# EAGLE design EWElectrode (EAGLE 7.5.0)
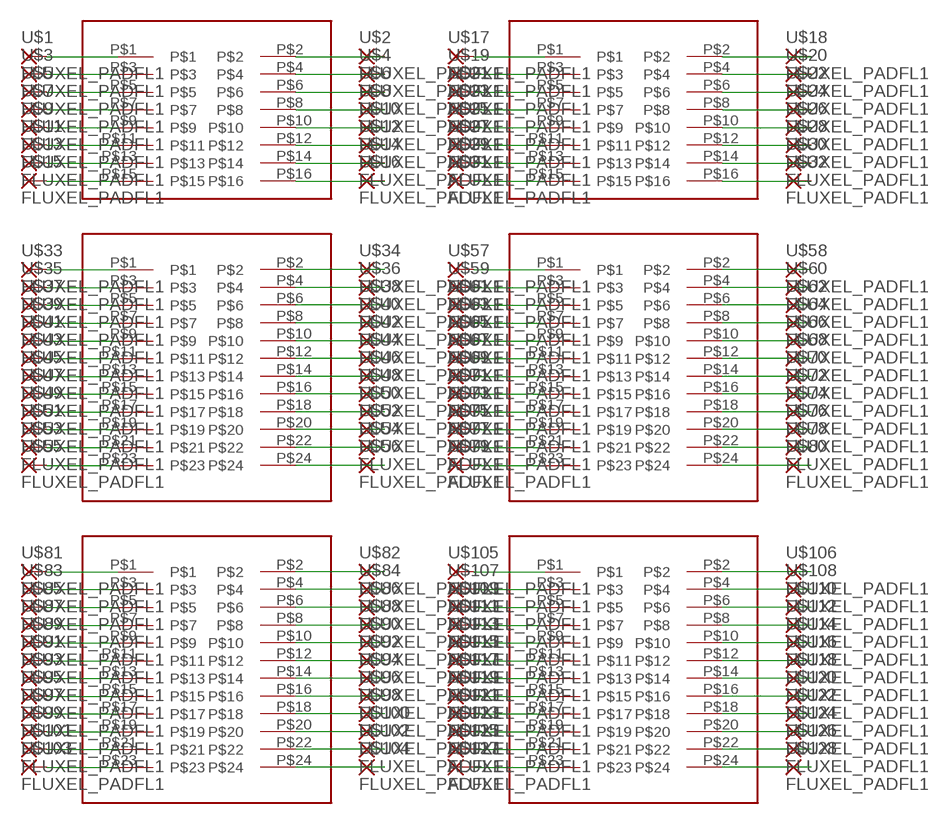
[diagram p0: schematic, sheet 1]

## Parts
J1  M20-876P_8X2  [M20-876P_8X2]
J2  M20-876P_8X2  [M20-876P_8X2]
J3  M20-876P_12X2  [M20-876P_12X2]
J4  M20-876P_12X2  [M20-876P_12X2]
J5  M20-876P_12X2  [M20-876P_12X2]
J6  M20-876P_12X2  [M20-876P_12X2]
U$1  FLUXEL_PADFL1  [FLUXEL_PAD]
U$2  FLUXEL_PADFL1  [FLUXEL_PAD]
U$3  FLUXEL_PADFL1  [FLUXEL_PAD]
U$4  FLUXEL_PADFL1  [FLUXEL_PAD]
U$5  FLUXEL_PADFL1  [FLUXEL_PAD]
U$6  FLUXEL_PADFL1  [FLUXEL_PAD]
U$7  FLUXEL_PADFL1  [FLUXEL_PAD]
U$8  FLUXEL_PADFL1  [FLUXEL_PAD]
U$9  FLUXEL_PADFL1  [FLUXEL_PAD]
U$10  FLUXEL_PADFL1  [FLUXEL_PAD]
U$11  FLUXEL_PADFL1  [FLUXEL_PAD]
U$12  FLUXEL_PADFL1  [FLUXEL_PAD]
U$13  FLUXEL_PADFL1  [FLUXEL_PAD]
U$14  FLUXEL_PADFL1  [FLUXEL_PAD]
U$15  FLUXEL_PADFL1  [FLUXEL_PAD]
U$16  FLUXEL_PADFL1  [FLUXEL_PAD]
U$17  FLUXEL_PADFL1  [FLUXEL_PAD]
U$18  FLUXEL_PADFL1  [FLUXEL_PAD]
U$19  FLUXEL_PADFL1  [FLUXEL_PAD]
U$20  FLUXEL_PADFL1  [FLUXEL_PAD]
U$21  FLUXEL_PADFL1  [FLUXEL_PAD]
U$22  FLUXEL_PADFL1  [FLUXEL_PAD]
U$23  FLUXEL_PADFL1  [FLUXEL_PAD]
U$24  FLUXEL_PADFL1  [FLUXEL_PAD]
U$25  FLUXEL_PADFL1  [FLUXEL_PAD]
U$26  FLUXEL_PADFL1  [FLUXEL_PAD]
U$27  FLUXEL_PADFL1  [FLUXEL_PAD]
U$28  FLUXEL_PADFL1  [FLUXEL_PAD]
U$29  FLUXEL_PADFL1  [FLUXEL_PAD]
U$30  FLUXEL_PADFL1  [FLUXEL_PAD]
U$31  FLUXEL_PADFL1  [FLUXEL_PAD]
U$32  FLUXEL_PADFL1  [FLUXEL_PAD]
U$33  FLUXEL_PADFL1  [FLUXEL_PAD]
U$34  FLUXEL_PADFL1  [FLUXEL_PAD]
U$35  FLUXEL_PADFL1  [FLUXEL_PAD]
U$36  FLUXEL_PADFL1  [FLUXEL_PAD]
U$37  FLUXEL_PADFL1  [FLUXEL_PAD]
U$38  FLUXEL_PADFL1  [FLUXEL_PAD]
U$39  FLUXEL_PADFL1  [FLUXEL_PAD]
U$40  FLUXEL_PADFL1  [FLUXEL_PAD]
U$41  FLUXEL_PADFL1  [FLUXEL_PAD]
U$42  FLUXEL_PADFL1  [FLUXEL_PAD]
U$43  FLUXEL_PADFL1  [FLUXEL_PAD]
U$44  FLUXEL_PADFL1  [FLUXEL_PAD]
U$45  FLUXEL_PADFL1  [FLUXEL_PAD]
U$46  FLUXEL_PADFL1  [FLUXEL_PAD]
U$47  FLUXEL_PADFL1  [FLUXEL_PAD]
U$48  FLUXEL_PADFL1  [FLUXEL_PAD]
U$49  FLUXEL_PADFL1  [FLUXEL_PAD]
U$50  FLUXEL_PADFL1  [FLUXEL_PAD]
U$51  FLUXEL_PADFL1  [FLUXEL_PAD]
U$52  FLUXEL_PADFL1  [FLUXEL_PAD]
U$53  FLUXEL_PADFL1  [FLUXEL_PAD]
U$54  FLUXEL_PADFL1  [FLUXEL_PAD]
U$55  FLUXEL_PADFL1  [FLUXEL_PAD]
U$56  FLUXEL_PADFL1  [FLUXEL_PAD]
U$57  FLUXEL_PADFL1  [FLUXEL_PAD]
U$58  FLUXEL_PADFL1  [FLUXEL_PAD]
U$59  FLUXEL_PADFL1  [FLUXEL_PAD]
U$60  FLUXEL_PADFL1  [FLUXEL_PAD]
U$61  FLUXEL_PADFL1  [FLUXEL_PAD]
U$62  FLUXEL_PADFL1  [FLUXEL_PAD]
U$63  FLUXEL_PADFL1  [FLUXEL_PAD]
U$64  FLUXEL_PADFL1  [FLUXEL_PAD]
U$65  FLUXEL_PADFL1  [FLUXEL_PAD]
U$66  FLUXEL_PADFL1  [FLUXEL_PAD]
U$67  FLUXEL_PADFL1  [FLUXEL_PAD]
U$68  FLUXEL_PADFL1  [FLUXEL_PAD]
U$69  FLUXEL_PADFL1  [FLUXEL_PAD]
U$70  FLUXEL_PADFL1  [FLUXEL_PAD]
U$71  FLUXEL_PADFL1  [FLUXEL_PAD]
U$72  FLUXEL_PADFL1  [FLUXEL_PAD]
U$73  FLUXEL_PADFL1  [FLUXEL_PAD]
U$74  FLUXEL_PADFL1  [FLUXEL_PAD]
U$75  FLUXEL_PADFL1  [FLUXEL_PAD]
U$76  FLUXEL_PADFL1  [FLUXEL_PAD]
U$77  FLUXEL_PADFL1  [FLUXEL_PAD]
U$78  FLUXEL_PADFL1  [FLUXEL_PAD]
U$79  FLUXEL_PADFL1  [FLUXEL_PAD]
U$80  FLUXEL_PADFL1  [FLUXEL_PAD]
U$81  FLUXEL_PADFL1  [FLUXEL_PAD]
U$82  FLUXEL_PADFL1  [FLUXEL_PAD]
U$83  FLUXEL_PADFL1  [FLUXEL_PAD]
U$84  FLUXEL_PADFL1  [FLUXEL_PAD]
U$85  FLUXEL_PADFL1  [FLUXEL_PAD]
U$86  FLUXEL_PADFL1  [FLUXEL_PAD]
U$87  FLUXEL_PADFL1  [FLUXEL_PAD]
U$88  FLUXEL_PADFL1  [FLUXEL_PAD]
U$89  FLUXEL_PADFL1  [FLUXEL_PAD]
U$90  FLUXEL_PADFL1  [FLUXEL_PAD]
U$91  FLUXEL_PADFL1  [FLUXEL_PAD]
U$92  FLUXEL_PADFL1  [FLUXEL_PAD]
U$93  FLUXEL_PADFL1  [FLUXEL_PAD]
U$94  FLUXEL_PADFL1  [FLUXEL_PAD]
U$95  FLUXEL_PADFL1  [FLUXEL_PAD]
U$96  FLUXEL_PADFL1  [FLUXEL_PAD]
U$97  FLUXEL_PADFL1  [FLUXEL_PAD]
U$98  FLUXEL_PADFL1  [FLUXEL_PAD]
U$99  FLUXEL_PADFL1  [FLUXEL_PAD]
U$100  FLUXEL_PADFL1  [FLUXEL_PAD]
U$101  FLUXEL_PADFL1  [FLUXEL_PAD]
U$102  FLUXEL_PADFL1  [FLUXEL_PAD]
U$103  FLUXEL_PADFL1  [FLUXEL_PAD]
U$104  FLUXEL_PADFL1  [FLUXEL_PAD]
U$105  FLUXEL_PADFL1  [FLUXEL_PAD]
U$106  FLUXEL_PADFL1  [FLUXEL_PAD]
U$107  FLUXEL_PADFL1  [FLUXEL_PAD]
U$108  FLUXEL_PADFL1  [FLUXEL_PAD]
U$109  FLUXEL_PADFL1  [FLUXEL_PAD]
U$110  FLUXEL_PADFL1  [FLUXEL_PAD]
U$111  FLUXEL_PADFL1  [FLUXEL_PAD]
U$112  FLUXEL_PADFL1  [FLUXEL_PAD]
U$113  FLUXEL_PADFL1  [FLUXEL_PAD]
U$114  FLUXEL_PADFL1  [FLUXEL_PAD]
U$115  FLUXEL_PADFL1  [FLUXEL_PAD]
U$116  FLUXEL_PADFL1  [FLUXEL_PAD]
U$117  FLUXEL_PADFL1  [FLUXEL_PAD]
U$118  FLUXEL_PADFL1  [FLUXEL_PAD]
U$119  FLUXEL_PADFL1  [FLUXEL_PAD]
U$120  FLUXEL_PADFL1  [FLUXEL_PAD]
U$121  FLUXEL_PADFL1  [FLUXEL_PAD]
U$122  FLUXEL_PADFL1  [FLUXEL_PAD]
U$123  FLUXEL_PADFL1  [FLUXEL_PAD]
U$124  FLUXEL_PADFL1  [FLUXEL_PAD]
U$125  FLUXEL_PADFL1  [FLUXEL_PAD]
U$126  FLUXEL_PADFL1  [FLUXEL_PAD]
U$127  FLUXEL_PADFL1  [FLUXEL_PAD]
U$128  FLUXEL_PADFL1  [FLUXEL_PAD]

## Nets
EW1: J1.P$1 U$1.1(P)
EW2: J1.P$3 U$3.1(P)
EW3: J1.P$5 U$5.1(P)
EW4: J1.P$7 U$7.1(P)
EW5: J1.P$9 U$9.1(P)
EW6: J1.P$11 U$11.1(P)
EW7: J1.P$13 U$13.1(P)
EW8: J1.P$15 U$15.1(P)
EW9: J1.P$2 U$2.1(P)
EW10: J1.P$4 U$4.1(P)
EW11: J1.P$6 U$6.1(P)
EW12: J1.P$8 U$8.1(P)
EW13: J1.P$10 U$10.1(P)
EW14: J1.P$12 U$12.1(P)
EW15: J1.P$14 U$14.1(P)
EW16: J1.P$16 U$16.1(P)
EW17: J2.P$1 U$17.1(P)
EW18: J2.P$3 U$19.1(P)
EW19: J2.P$5 U$21.1(P)
EW20: J2.P$7 U$23.1(P)
EW21: J2.P$9 U$25.1(P)
EW22: J2.P$11 U$27.1(P)
EW23: J2.P$13 U$29.1(P)
EW24: J2.P$15 U$31.1(P)
EW25: J2.P$2 U$18.1(P)
EW26: J2.P$4 U$20.1(P)
EW27: J2.P$6 U$22.1(P)
EW28: J2.P$8 U$24.1(P)
EW29: J2.P$10 U$26.1(P)
EW30: J2.P$12 U$28.1(P)
EW31: J2.P$14 U$30.1(P)
EW32: J2.P$16 U$32.1(P)
EW34: J3.P$3 U$35.1(P)
EW35: J3.P$5 U$37.1(P)
EW36: J3.P$7 U$39.1(P)
EW37: J3.P$9 U$41.1(P)
EW38: J3.P$11 U$43.1(P)
EW39: J3.P$13 U$45.1(P)
EW40: J3.P$15 U$47.1(P)
EW41: J3.P$17 U$49.1(P)
EW42: J3.P$19 U$51.1(P)
EW44: J3.P$23 U$55.1(P)
EW45: J3.P$2 U$34.1(P)
EW46: J3.P$4 U$36.1(P)
EW47: J3.P$6 U$38.1(P)
EW48: J3.P$8 U$40.1(P)
EW49: J3.P$10 U$42.1(P)
EW50: J3.P$12 U$44.1(P)
EW51: J3.P$14 U$46.1(P)
EW52: J3.P$16 U$48.1(P)
EW53: J3.P$18 U$50.1(P)
EW54: J3.P$20 U$52.1(P)
EW55: J3.P$22 U$54.1(P)
EW56: J3.P$24 U$56.1(P)
EW57: J4.P$1 U$57.1(P)
EW58: J4.P$3 U$59.1(P)
EW59: J4.P$5 U$61.1(P)
EW60: J4.P$7 U$63.1(P)
EW61: J4.P$9 U$65.1(P)
EW62: J4.P$11 U$67.1(P)
EW63: J4.P$13 U$69.1(P)
EW64: J4.P$15 U$71.1(P)
EW65: J4.P$17 U$73.1(P)
EW66: J4.P$19 U$75.1(P)
EW67: J4.P$21 U$77.1(P)
EW68: J4.P$23 U$79.1(P)
EW69: J4.P$2 U$58.1(P)
EW70: J4.P$4 U$60.1(P)
EW71: J4.P$6 U$62.1(P)
EW72: J4.P$8 U$64.1(P)
EW73: J4.P$10 U$66.1(P)
EW74: J4.P$12 U$68.1(P)
EW75: J4.P$14 U$70.1(P)
EW76: J4.P$16 U$72.1(P)
EW77: J4.P$18 U$74.1(P)
EW78: J4.P$20 U$76.1(P)
EW79: J4.P$22 U$78.1(P)
EW80: J4.P$24 U$80.1(P)
EW81: J5.P$1 U$81.1(P)
EW82: J5.P$3 U$83.1(P)
EW83: J5.P$5 U$85.1(P)
EW84: J5.P$7 U$87.1(P)
EW85: J5.P$9 U$89.1(P)
EW86: J5.P$11 U$91.1(P)
EW87: J5.P$13 U$93.1(P)
EW88: J5.P$15 U$95.1(P)
EW90: J5.P$19 U$99.1(P)
EW91: J5.P$21 U$101.1(P)
EW92: J5.P$23 U$103.1(P)
EW93: J5.P$2 U$82.1(P)
EW94: J5.P$4 U$84.1(P)
EW95: J5.P$6 U$86.1(P)
EW96: J5.P$8 U$88.1(P)
EW97: J5.P$10 U$90.1(P)
EW98: J5.P$12 U$92.1(P)
EW99: J5.P$14 U$94.1(P)
EW100: J5.P$16 U$96.1(P)
EW102: J5.P$20 U$100.1(P)
EW105: J6.P$1 U$105.1(P)
EW106: J6.P$3 U$107.1(P)
EW107: J6.P$5 U$109.1(P)
EW108: J6.P$7 U$111.1(P)
EW109: J6.P$9 U$113.1(P)
EW110: J6.P$11 U$115.1(P)
EW111: J6.P$13 U$117.1(P)
EW112: J6.P$15 U$119.1(P)
EW113: J6.P$17 U$121.1(P)
EW114: J6.P$19 U$123.1(P)
EW115: J6.P$21 U$125.1(P)
EW116: J6.P$23 U$127.1(P)
EW117: J6.P$2 U$106.1(P)
EW118: J6.P$4 U$108.1(P)
EW119: J6.P$6 U$110.1(P)
EW120: J6.P$8 U$112.1(P)
EW121: J6.P$10 U$114.1(P)
EW122: J6.P$12 U$116.1(P)
EW123: J6.P$14 U$118.1(P)
EW124: J6.P$16 U$120.1(P)
EW125: J6.P$18 U$122.1(P)
EW126: J6.P$20 U$124.1(P)
EW127: J6.P$22 U$126.1(P)
EW128: J6.P$24 U$128.1(P)
EW137: J3.P$21 U$53.1(P)
EW166: J5.P$18 U$98.1(P)
EW236: J5.P$17 U$97.1(P)
EW261: J3.P$1 U$33.1(P)
EW287: J5.P$22 U$102.1(P)
EW289: J5.P$24 U$104.1(P)

## Library data of the parts
J1 J2 = ben:M20-876P_8X2
J3-J6 = ben:M20-876P_12X2
U$1-U$128 = ben:FLUXEL_PAD

## Board
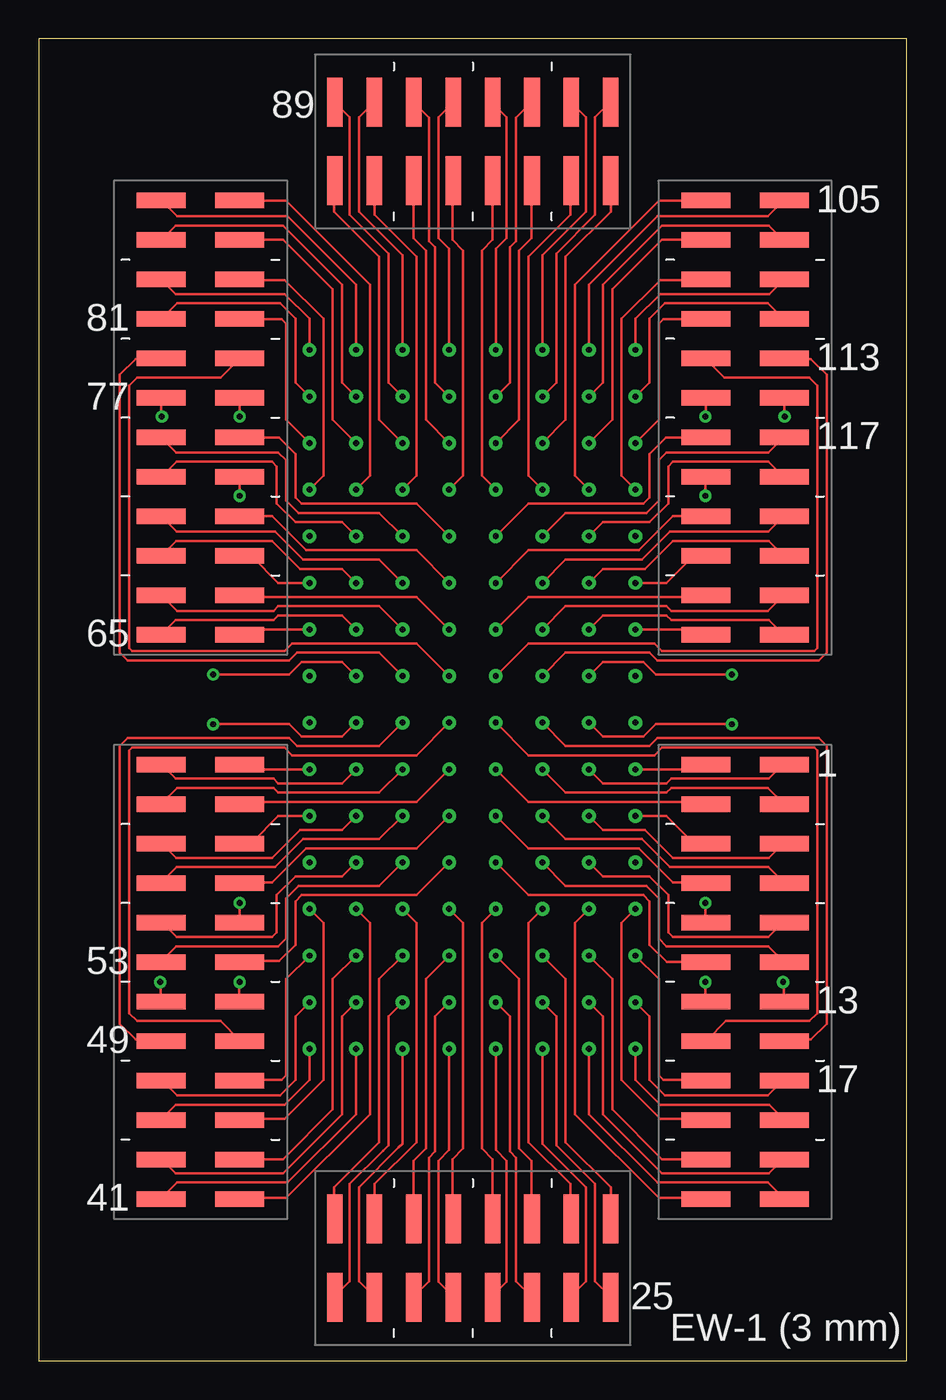
[diagram p1: board, top side]
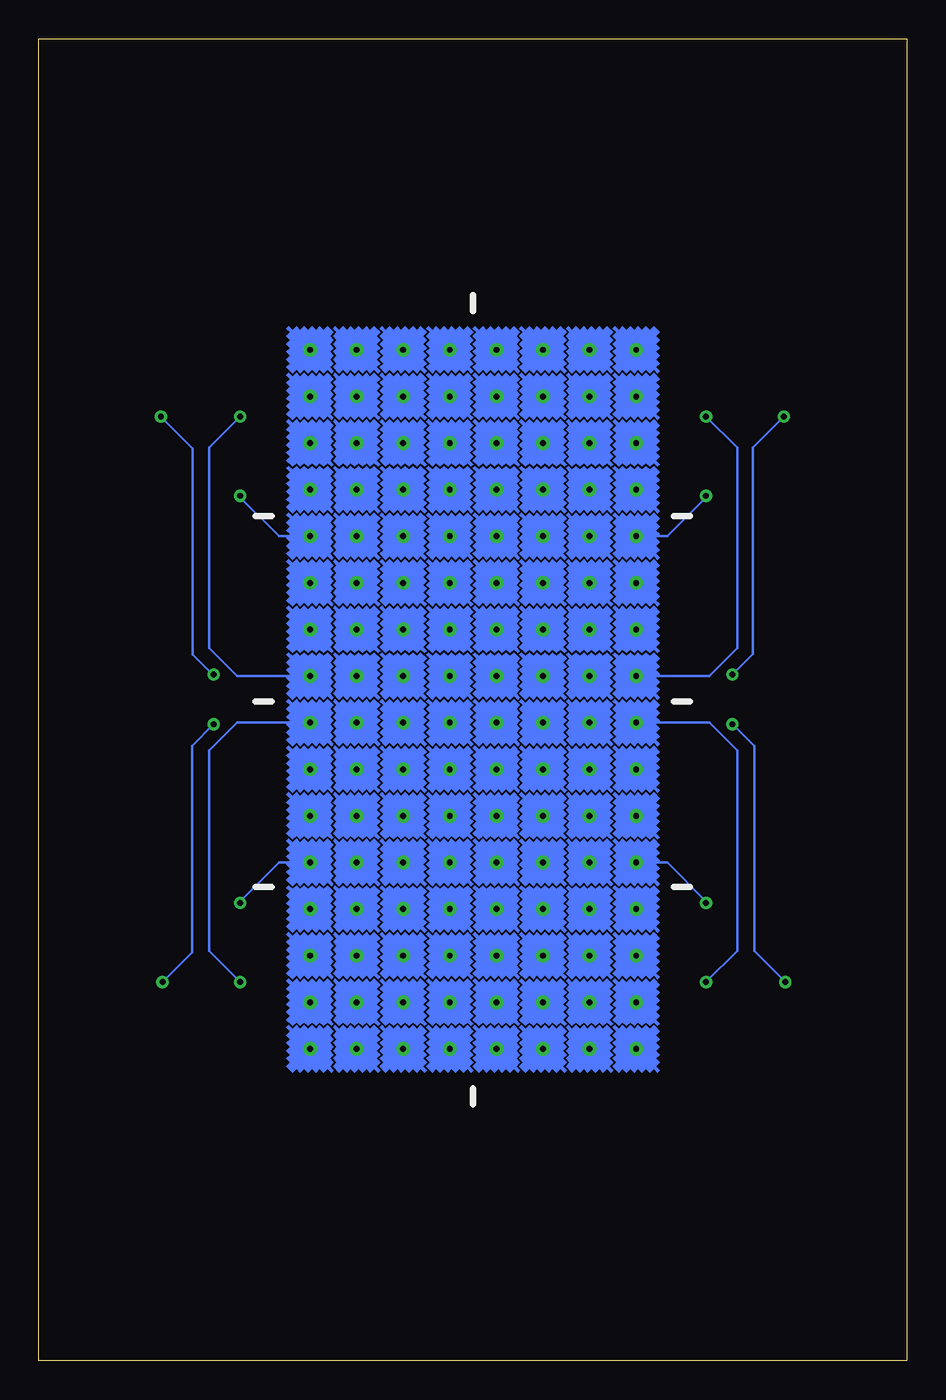
[diagram p2: board, bottom side, seen from below]

Size 55.88 x 85.09 mm. Coordinates in mm from the lower left corner, seen from the top.
Outline: 0,0 55.88,0 55.88,85.09 0,85.09 0,0
Copper layers (1*16): Top 0.035559375mm / dielectric 1.501140625mm / Bottom 0.035559375mm
Design rules "typical_4pcb *": minimum track width 6mil, minimum drill 15mil, track to track 6mil, track to pad 6mil, pad to pad 6mil, via to via 6mil, smd to smd 6mil, copper to edge 15mil, drill to drill 8mil, minimum pad ring 10mil, minimum via ring 8mil, stop-mask expansion 4mil, vias tented up to drill 0mil, thermal gap 10mil

### Footprints (pad centres in the part's own frame; a part is rotated, then mirrored left to right if it is on the bottom)
M20-876P_8X2 = smd 1 x 3.15: P$1 -8.89,-2.525; P$2 -8.89,2.525; P$3 -6.35,-2.525; P$4 -6.35,2.525; P$5 -3.81,-2.525; P$6 -3.81,2.525; P$7 -1.27,-2.525; P$8 -1.27,2.525; P$9 1.27,-2.525; P$10 1.27,2.525; P$11 3.81,-2.525; P$12 3.81,2.525; P$13 6.35,-2.525; P$14 6.35,2.525; P$15 8.89,-2.525; P$16 8.89,2.525
M20-876P_12X2 = smd 1 x 3.15: P$1 -13.97,-2.525; P$2 -13.97,2.525; P$3 -11.43,-2.525; P$4 -11.43,2.525; P$5 -8.89,-2.525; P$6 -8.89,2.525; P$7 -6.35,-2.525; P$8 -6.35,2.525; P$9 -3.81,-2.525; P$10 -3.81,2.525; P$11 -1.27,-2.525; P$12 -1.27,2.525; P$13 1.27,-2.525; P$14 1.27,2.525; P$15 3.81,-2.525; P$16 3.81,2.525; P$17 6.35,-2.525; P$18 6.35,2.525; P$19 8.89,-2.525; P$20 8.89,2.525; P$21 11.43,-2.525; P$22 11.43,2.525; P$23 13.97,-2.525; P$24 13.97,2.525
FLUXEL_PAD = drill 0.381 pad 0.635: 1 0,0

### Placement (x,y rotation side)
J1  27.94,78.49 0 top
J2  27.94,6.6 0 top
J3  10.41,24.38 90 top
J4  45.47,24.38 270 top
J5  10.41,60.71 90 top
J6  45.47,60.71 270 top
U$1  23.42,59.07 0 top
U$2  23.42,62.07 0 top
U$3  23.42,56.07 0 top
U$4  23.42,65.07 0 top
U$5  26.42,59.07 0 top
U$6  26.42,62.07 0 top
U$7  26.42,56.07 0 top
U$8  26.42,65.07 0 top
U$9  29.42,56.07 0 top
U$10  29.42,65.07 0 top
U$11  29.42,59.07 180 top
U$12  29.42,62.07 180 top
U$13  32.42,56.07 0 top
U$14  32.42,65.07 0 top
U$15  32.42,59.07 0 top
U$16  32.42,62.07 0 top
U$17  23.42,23.07 0 top
U$18  23.42,26.07 0 top
U$19  23.42,20.07 0 top
U$20  23.42,29.07 0 top
U$21  26.42,23.07 0 top
U$22  26.42,26.07 0 top
U$23  26.42,20.07 0 top
U$24  26.42,29.07 0 top
U$25  29.42,20.07 0 top
U$26  29.42,29.07 0 top
U$27  29.42,23.07 0 top
U$28  29.42,26.07 0 top
U$29  32.42,20.07 0 top
U$30  32.42,29.07 0 top
U$31  32.42,23.07 0 top
U$32  32.42,26.07 0 top
U$33  20.42,29.07 0 top
U$34  20.42,20.07 0 top
U$35  20.42,26.07 0 top
U$36  20.42,23.07 0 top
U$37  17.42,29.07 0 top
U$38  17.42,20.07 0 top
U$39  17.42,26.07 0 top
U$40  17.42,23.07 0 top
U$41  26.42,41.07 0 top
U$42  23.42,41.07 0 top
U$43  17.42,41.07 0 top
U$44  20.42,41.07 0 top
U$45  26.42,32.07 0 top
U$46  23.42,32.07 0 top
U$47  17.42,32.07 0 top
U$48  20.42,32.07 0 top
U$49  26.42,35.07 0 top
U$50  23.42,35.07 0 top
U$51  17.42,35.07 0 top
U$52  20.42,35.07 0 top
U$53  26.42,38.07 0 top
U$54  23.42,38.07 0 top
U$55  17.42,38.07 0 top
U$56  20.42,38.07 0 top
U$57  38.42,38.07 0 top
U$58  35.42,38.07 0 top
U$59  29.42,38.07 0 top
U$60  32.42,38.07 0 top
U$61  38.42,35.07 0 top
U$62  35.42,35.07 0 top
U$63  29.42,35.07 0 top
U$64  32.42,35.07 0 top
U$65  38.42,32.07 0 top
U$66  35.42,32.07 0 top
U$67  29.42,32.07 0 top
U$68  32.42,32.07 0 top
U$69  38.42,41.07 0 top
U$70  35.42,41.07 0 top
U$71  29.42,41.07 0 top
U$72  32.42,41.07 0 top
U$73  38.42,26.07 0 top
U$74  38.42,23.07 0 top
U$75  38.42,29.07 0 top
U$76  38.42,20.07 0 top
U$77  35.42,26.07 0 top
U$78  35.42,23.07 0 top
U$79  35.42,29.07 0 top
U$80  35.42,20.07 0 top
U$81  17.42,47.07 0 top
U$82  20.42,47.07 0 top
U$83  26.42,47.07 0 top
U$84  23.42,47.07 0 top
U$85  17.42,50.07 0 top
U$86  20.42,50.07 0 top
U$87  26.42,50.07 0 top
U$88  23.42,50.07 0 top
U$89  17.42,53.07 0 top
U$90  20.42,53.07 0 top
U$91  26.42,53.07 0 top
U$92  23.42,53.07 0 top
U$93  17.42,44.07 0 top
U$94  20.42,44.07 0 top
U$95  26.42,44.07 0 top
U$96  23.42,44.07 0 top
U$97  17.42,59.07 0 top
U$98  17.42,62.07 0 top
U$99  17.42,56.07 0 top
U$100  17.42,65.07 0 top
U$101  20.42,59.07 0 top
U$102  20.42,62.07 0 top
U$103  20.42,56.07 0 top
U$104  20.42,65.07 0 top
U$105  35.42,56.07 0 top
U$106  35.42,65.07 0 top
U$107  35.42,59.07 0 top
U$108  35.42,62.07 0 top
U$109  38.42,56.07 0 top
U$110  38.42,65.07 0 top
U$111  38.42,59.07 0 top
U$112  38.42,62.07 0 top
U$113  29.42,44.07 0 top
U$114  32.42,44.07 0 top
U$115  38.42,44.07 0 top
U$116  35.42,44.07 0 top
U$117  29.42,53.07 0 top
U$118  32.42,53.07 0 top
U$119  38.42,53.07 0 top
U$120  35.42,53.07 0 top
U$121  29.42,50.07 0 top
U$122  32.42,50.07 0 top
U$123  38.42,50.07 0 top
U$124  35.42,50.07 0 top
U$125  29.42,47.07 0 top
U$126  32.42,47.07 0 top
U$127  38.42,47.07 0 top
U$128  35.42,47.07 0 top

### Tracks (layer width: path | path; a pad name or v marks a point on that pad's centre or on a via)
EW1
  Top 0.152: U$1.1 21.92,60.57 21.92,71.07 19.02,73.97 19.02,75.93 J1.P$1
EW2
  Top 0.152: U$3.1 24.32,56.97 24.32,71.07 21.62,73.77 21.62,75.93 J1.P$3
EW3
  Top 0.152: U$5.1 24.92,60.57 24.92,71.47 24.12,72.27 J1.P$5
EW4
  Top 0.152: U$7.1 27.32,56.97 27.32,71.47 26.62,72.17 26.62,75.91 J1.P$7
EW5
  Top 0.152: U$9.1 28.52,56.97 28.52,71.47 29.22,72.17 29.22,75.91 | 29.22,75.91 29.17,75.96 | 29.22,75.91 J1.P$9
EW6
  Top 0.152: U$11.1 30.92,60.57 30.92,71.47 31.72,72.27 31.72,75.95 | 31.72,75.95 31.71,75.96 | J1.P$11 31.73,75.96 31.72,75.95
EW7
  Top 0.152: U$13.1 31.52,56.97 31.52,71.07 34.22,73.77 34.22,75.93 34.25,75.96 J1.P$13
EW8
  Top 0.152: U$15.1 33.92,60.57 33.92,71.07 36.82,73.97 36.82,75.93 | 36.82,75.93 36.79,75.96 | J1.P$15 36.83,75.94 36.82,75.93
EW9
  Top 0.152: U$2.1 22.52,62.97 22.52,71.27 20.02,73.77 20.02,80.04 J1.P$2
EW10
  Top 0.152: U$4.1 23.42,71.17 20.62,73.97 20.62,80.04 J1.P$4
EW11
  Top 0.152: U$6.1 25.52,62.97 25.52,71.67 25.12,72.07 25.12,80.02 J1.P$6
EW12
  Top 0.152: U$8.1 26.42,71.57 25.72,72.27 25.72,80.06 J1.P$8
EW13
  Top 0.152: U$10.1 29.42,71.57 30.12,72.27 30.12,80.06 29.22,80.96 29.21,80.97 | 29.21,80.97 29.17,81.01 | J1.P$10 29.21,80.97
EW14
  Top 0.152: U$12.1 30.32,62.97 30.32,71.67 30.72,72.07 30.72,80.02 31.71,81.01 J1.P$12
EW15
  Top 0.152: U$14.1 32.42,71.17 35.22,73.97 35.22,80.04 34.31,80.96 34.29,80.97 | 34.29,80.97 34.25,81.01 | J1.P$14 34.29,80.97
EW16
  Top 0.152: U$16.1 33.32,62.97 33.32,71.27 35.82,73.77 35.82,80.04 36.79,81.01 J1.P$16
EW17
  Top 0.152: U$17.1 22.52,22.17 22.52,13.87 22.17,13.52 20.02,11.37 20.02,5.1 19.05,4.13 | 19.01,4.13 19.05,4.13 | J2.P$1 19.05,4.13
EW18
  Top 0.152: 21.55,4.17 20.62,5.1 20.62,11.17 23.17,13.72 23.42,13.97 U$19.1 | 21.55,4.17 21.59,4.13 J2.P$3 | 21.55,4.13 21.55,4.17
EW19
  Top 0.152: U$21.1 25.52,22.17 25.52,13.47 25.12,13.07 25.12,5.12 24.13,4.13 | 24.09,4.13 24.13,4.13 | 24.13,4.13 J2.P$5
EW20
  Top 0.152: 26.63,4.17 25.72,5.08 25.72,12.87 26.42,13.57 U$23.1 | 26.63,4.17 26.67,4.13 | 26.63,4.17 26.63,4.13 J2.P$7
EW21
  Top 0.152: U$25.1 29.42,13.57 30.12,12.87 30.12,5.08 29.21,4.17 | 29.21,4.17 29.17,4.13 J2.P$9 | 29.21,4.13 29.21,4.17
EW22
  Top 0.152: U$27.1 30.32,22.17 30.32,13.47 30.72,13.07 30.72,5.12 31.71,4.13 | 31.75,4.13 31.71,4.13 | J2.P$11 31.71,4.13
EW23
  Top 0.152: U$29.1 32.42,13.97 35.22,11.17 35.22,5.1 34.29,4.17 | 34.29,4.17 34.25,4.13 J2.P$13 | 34.29,4.13 34.29,4.17
EW24
  Top 0.152: U$31.1 33.32,22.17 33.32,13.87 35.82,11.37 35.82,5.1 36.79,4.13 36.83,4.13 J2.P$15
EW25
  Top 0.152: U$18.1 21.92,24.57 21.92,14.07 19.02,11.17 19.02,9.21 | 19.02,9.21 19.05,9.18 | 19.02,9.21 19.01,9.2 19.01,9.18 J2.P$2
EW26
  Top 0.152: U$20.1 24.32,28.17 24.32,14.07 21.62,11.37 21.62,9.21 21.59,9.18 21.55,9.18 J2.P$4
EW27
  Top 0.152: U$22.1 24.92,24.57 24.92,13.67 24.12,12.87 24.12,9.19 | 24.12,9.19 24.13,9.18 J2.P$6 | 24.09,9.18 24.11,9.18 24.12,9.19
EW28
  Top 0.152: U$24.1 27.32,28.17 27.32,13.67 26.62,12.97 26.62,9.23 | 26.62,9.23 26.67,9.18 J2.P$8 | 26.62,9.23 26.62,9.19 26.63,9.18
EW29
  Top 0.152: 29.22,9.23 29.22,12.97 28.52,13.67 28.52,28.17 U$26.1 | 29.22,9.23 29.17,9.18 | 29.22,9.23 29.22,9.19 29.21,9.18 J2.P$10
EW30
  Top 0.152: U$28.1 30.92,24.57 30.92,13.67 31.72,12.87 31.72,9.19 | 31.72,9.19 31.71,9.18 J2.P$12 | 31.75,9.18 31.73,9.18 31.72,9.19
EW31
  Top 0.152: U$30.1 31.52,28.17 31.52,14.07 34.22,11.37 34.22,9.21 34.25,9.18 34.29,9.18 J2.P$14
EW32
  Top 0.152: U$32.1 33.92,24.57 33.92,14.07 36.82,11.17 36.82,9.21 | 36.82,9.21 36.79,9.18 | 36.82,9.21 36.83,9.2 36.83,9.18 J2.P$16
EW34
  Top 0.152: U$35.1 18.92,24.57 18.92,16.17 15.72,12.97 12.97,12.97 | 12.97,12.97 12.94,13 12.9,13 | 12.97,12.97 12.96,12.97 J3.P$3
EW35
  Top 0.152: U$37.1 18.32,28.17 18.32,18.07 15.82,15.57 12.96,15.57 12.94,15.54 | 12.9,15.54 12.94,15.54 | J3.P$5 12.94,15.54
EW36
  Top 0.152: U$39.1 15.92,24.57 15.92,18.37 15.63,18.08 12.9,18.08 12.94,18.04 J3.P$7
EW37
  Top 0.152: U$41.1 24.32,38.97 16.32,38.97 15.82,39.47 6.02,39.47 5.82,39.27 5.82,22.37 6.32,21.87 11.69,21.87 12.94,20.62 | 12.94,20.62 12.9,20.62 | J3.P$9 12.94,20.62
EW38  (via drill 0.38)
  Top 0.152: v12.92,24.37 12.9,24.35 12.9,23.15 J3.P$11
  Bottom 0.152: U$43.1 12.72,41.07 10.92,39.27 10.92,26.37 v12.92,24.37
EW39
  Top 0.152: U$45.1 24.32,29.97 16.92,29.97 16.52,29.57 16.52,26.77 15.47,25.72 12.96,25.72 12.94,25.7 12.9,25.7 12.94,25.66 J3.P$13
EW40  (via drill 0.38)
  Top 0.152: v12.92,29.47 12.92,28.26 12.94,28.24 | 12.9,28.24 12.94,28.24 | J3.P$15 12.94,28.24
  Bottom 0.152: U$47.1 15.42,32.07 12.92,29.57 v12.92,29.47
EW41
  Top 0.152: U$49.1 24.32,32.97 17.22,32.97 15.02,30.77 13.02,30.77 | 13.02,30.77 12.95,30.77 12.94,30.78 12.9,30.78 | J3.P$17 12.98,30.73 13.02,30.77
EW42
  Top 0.152: U$51.1 15.42,35.07 13.72,33.37 12.98,33.37 12.94,33.32 | 12.9,33.32 12.94,33.32 | J3.P$19 12.94,33.32
EW44
  Top 0.152: U$55.1 13.27,38.07 12.94,38.4 | 12.9,38.4 12.94,38.4 | 12.94,38.4 J3.P$23
EW45
  Top 0.152: 7.85,10.46 7.89,10.46 | U$34.1 20.42,15.87 16.02,11.47 8.89,11.47 7.91,10.48 7.89,10.46 | J3.P$2 7.89,10.46
EW46
  Top 0.152: U$36.1 19.52,22.17 19.52,15.87 15.72,12.07 8.82,12.07 7.92,12.97 | 7.92,12.97 7.89,13 7.85,13 | J3.P$4 7.9,12.95 7.92,12.97
EW47
  Top 0.152: U$38.1 17.42,18.07 15.82,16.47 8.81,16.47 7.89,15.54 | 7.85,15.54 7.89,15.54 | 7.89,15.54 J3.P$6
EW48
  Top 0.152: U$40.1 16.52,22.17 16.52,18.07 15.52,17.07 8.9,17.07 7.89,18.08 | 7.85,18.08 7.89,18.08 | 7.89,18.08 J3.P$8
EW49
  Top 0.152: U$42.1 21.92,39.57 16.62,39.57 16.12,40.07 5.72,40.07 5.22,39.57 5.22,21.67 6.22,20.67 7.8,20.67 | 7.8,20.67 7.84,20.67 7.89,20.62 | 7.8,20.67 7.85,20.62 7.85,20.61 J3.P$10
EW50  (via drill 0.38)
  Top 0.152: U$44.1 19.52,40.17 16.92,40.17 16.12,40.97 v11.22,40.97 | v7.82,24.37 7.85,24.34 7.85,23.15 J3.P$12
  Bottom 0.152: v11.22,40.97 9.82,39.57 9.82,26.37 v7.82,24.37 v7.82,24.38
EW51
  Top 0.152: U$46.1 21.92,30.57 16.72,30.57 15.92,29.77 15.92,27.17 15.42,26.67 8.86,26.67 7.89,25.7 7.85,25.7 7.89,25.66 J3.P$14
EW52
  Top 0.152: U$48.1 19.52,31.17 16.52,31.17 15.32,29.97 15.32,27.57 15.02,27.27 8.86,27.27 7.89,28.24 7.85,28.24 7.89,28.2 J3.P$16
EW53
  Top 0.152: U$50.1 21.92,33.57 17.02,33.57 15.22,31.77 8.88,31.77 7.89,30.78 | 7.85,30.78 7.89,30.78 | 7.89,30.78 J3.P$18
EW54
  Top 0.152: U$52.1 19.52,34.17 16.82,34.17 15.02,32.37 8.84,32.37 8.03,33.18 7.94,33.27 | 7.94,33.27 7.89,33.32 7.85,33.32 | J3.P$20 7.94,33.27
EW55
  Top 0.152: U$54.1 21.92,36.57 15.42,36.57 15.12,36.87 8.89,36.87 7.89,35.86 | 7.85,35.86 7.89,35.86 | 7.89,35.86 J3.P$22
EW56
  Top 0.152: U$56.1 19.52,37.17 15.42,37.17 15.12,37.47 8.82,37.47 7.97,38.32 7.94,38.35 | 7.94,38.35 7.89,38.4 7.85,38.4 | J3.P$24 7.94,38.35
EW57
  Top 0.152: 42.62,37.97 42.62,38.03 J4.P$1 42.2,38.35 41.92,38.07 U$57.1
EW58
  Top 0.152: U$59.1 31.52,35.97 42.78,35.97 J4.P$3
EW59
  Top 0.152: U$61.1 40.42,35.07 42.12,33.37 42.85,33.37 42.9,33.32 42.9,33.31 J4.P$5
EW60
  Top 0.152: U$63.1 31.52,32.97 38.62,32.97 40.82,30.77 42.89,30.77 | 42.89,30.77 42.9,30.78 | J4.P$7 42.92,30.73 42.89,30.77
EW61  (via drill 0.38)
  Top 0.152: v42.92,29.47 42.92,28.26 | 42.92,28.26 42.9,28.24 | J4.P$9 43.34,28.19 43.42,28.27 42.93,28.27 42.92,28.26
  Bottom 0.152: U$65.1 40.42,32.07 42.92,29.57 v42.92,29.47
EW62
  Top 0.152: U$67.1 31.52,29.97 38.92,29.97 39.32,29.57 39.32,26.77 40.44,25.65 J4.P$11
EW63  (via drill 0.38)
  Top 0.152: v42.92,24.37 42.92,23.18 | 42.92,23.18 42.9,23.16 | J4.P$13 42.92,23.13 42.92,23.18
  Bottom 0.152: U$69.1 43.12,41.07 44.92,39.27 44.92,26.37 v42.92,24.37
EW64
  Top 0.152: U$71.1 31.52,38.97 39.62,38.97 40.12,39.47 49.92,39.47 50.12,39.27 50.12,22.37 49.62,21.87 44.25,21.87 43,20.62 42.99,20.62 J4.P$15
EW65
  Top 0.152: U$73.1 39.92,24.57 39.92,18.37 40.21,18.08 42.94,18.08 J4.P$17
EW66
  Top 0.152: U$75.1 37.52,28.17 37.52,18.07 40.02,15.57 42.88,15.57 42.9,15.54 42.94,15.54 J4.P$19
EW67
  Top 0.152: U$77.1 36.92,24.57 36.92,16.17 40.12,12.97 42.87,12.97 42.89,13 | 42.89,13 42.9,13 42.94,13 42.93,13 42.89,13 | J4.P$21 42.89,13
EW68
  Top 0.152: 42.82,10.47 39.92,10.47 34.52,15.87 34.52,28.17 U$79.1 | 42.82,10.47 42.89,10.47 42.9,10.46 42.94,10.46 | J4.P$23 42.88,10.41 42.82,10.47
EW69
  Top 0.152: U$58.1 36.32,37.17 40.42,37.17 40.72,37.47 47.02,37.47 47.95,38.4 47.99,38.36 J4.P$2
EW70
  Top 0.152: U$60.1 33.92,36.57 40.42,36.57 40.72,36.87 46.95,36.87 47.95,35.86 47.95,35.85 J4.P$4
EW71
  Top 0.152: U$62.1 36.32,34.17 39.02,34.17 40.82,32.37 47,32.37 47.95,33.32 47.99,33.28 J4.P$6
EW72
  Top 0.152: U$64.1 33.92,33.57 38.82,33.57 40.62,31.77 46.96,31.77 47.95,30.78 47.95,30.77 J4.P$8
EW73
  Top 0.152: U$66.1 36.32,31.17 39.32,31.17 40.52,29.97 40.52,27.57 40.82,27.27 46.98,27.27 47.95,28.24 47.95,28.23 J4.P$10
EW74
  Top 0.152: U$68.1 33.92,30.57 39.12,30.57 39.92,29.77 39.92,27.17 40.42,26.67 46.98,26.67 47.99,25.66 J4.P$12
EW75  (via drill 0.38)
  Top 0.152: U$70.1 36.32,40.17 38.92,40.17 39.72,40.97 v44.62,40.97 | v47.92,24.37 47.95,24.14 47.95,23.15 J4.P$14
  Bottom 0.152: v44.62,40.97 46.02,39.57 46.02,26.27 v47.92,24.37 47.92,24.48
EW76
  Top 0.152: U$72.1 33.92,39.57 39.32,39.57 39.82,40.07 50.22,40.07 50.72,39.57 50.72,21.67 49.72,20.67 48.1,20.67 48,20.57 J4.P$16
EW77
  Top 0.152: U$74.1 39.32,22.17 39.32,18.07 40.32,17.07 46.94,17.07 47.95,18.08 47.95,18.07 J4.P$18
EW78
  Top 0.152: U$76.1 38.42,18.07 40.02,16.47 47.02,16.47 47.99,15.5 J4.P$20
EW79
  Top 0.152: U$78.1 36.32,22.17 36.32,15.87 40.12,12.07 47.02,12.07 47.95,13 47.99,12.96 J4.P$22
EW80
  Top 0.152: U$80.1 35.42,15.87 39.82,11.47 46.95,11.47 47.99,10.42 J4.P$24
EW81
  Top 0.152: U$81.1 13.27,47.07 J5.P$1
EW82
  Top 0.152: U$83.1 24.32,49.17 13.04,49.17 J5.P$3
EW83
  Top 0.152: U$85.1 15.42,50.07 13.72,51.77 12.98,51.77 J5.P$5
EW84
  Top 0.152: U$87.1 24.32,52.17 17.22,52.17 15.02,54.37 12.95,54.37 J5.P$7
EW85  (via drill 0.38)
  Top 0.152: v12.92,55.67 12.92,56.88 J5.P$9
  Bottom 0.152: U$89.1 15.42,53.07 12.92,55.57 v12.92,55.67
EW86
  Top 0.152: J5.P$11 12.96,59.42 15.47,59.42 16.52,58.37 16.52,55.57 16.92,55.17 24.32,55.17 U$91.1
EW87  (via drill 0.38)
  Top 0.152: v12.92,60.77 12.92,61.96 J5.P$13
  Bottom 0.152: U$93.1 12.72,44.07 10.92,45.87 10.92,58.77 v12.92,60.77
EW88
  Top 0.152: U$95.1 24.32,46.17 16.32,46.17 15.82,45.67 6.02,45.67 5.82,45.87 5.82,62.77 6.32,63.27 11.69,63.27 J5.P$15
EW90
  Top 0.152: U$99.1 18.32,56.97 18.32,67.07 15.82,69.57 12.96,69.57 J5.P$19
EW91
  Top 0.152: U$101.1 18.92,60.57 18.92,68.97 15.72,72.17 12.97,72.17 J5.P$21
EW92
  Top 0.152: U$103.1 21.32,56.97 21.32,69.27 15.92,74.67 J5.P$23
EW93
  Top 0.152: U$82.1 19.52,47.97 15.42,47.97 15.12,47.67 8.82,47.67 J5.P$2
EW94
  Top 0.152: U$84.1 21.92,48.57 15.42,48.57 15.12,48.27 8.89,48.27 J5.P$4
EW95
  Top 0.152: U$86.1 19.52,50.97 16.82,50.97 15.02,52.77 8.84,52.77 J5.P$6
EW96
  Top 0.152: U$88.1 21.92,51.57 17.02,51.57 15.22,53.37 8.88,53.37 J5.P$8
EW97
  Top 0.152: U$90.1 19.52,53.97 16.52,53.97 15.32,55.17 15.32,57.57 15.02,57.87 8.86,57.87 J5.P$10
EW98
  Top 0.152: U$92.1 21.92,54.57 16.72,54.57 15.92,55.37 15.92,57.97 15.42,58.47 8.86,58.47 J5.P$12
EW99  (via drill 0.38)
  Top 0.152: U$94.1 19.52,44.97 16.92,44.97 16.12,44.17 v11.22,44.17 | J5.P$14 7.89,61 v7.92,60.77
  Bottom 0.152: v7.92,60.77 v7.92,60.76 9.91,58.77 9.91,45.48 v11.22,44.17
EW100
  Top 0.152: U$96.1 21.92,45.57 16.62,45.57 16.12,45.07 5.72,45.07 5.22,45.57 5.22,63.47 6.22,64.47 7.84,64.47 J5.P$16
EW102
  Top 0.152: U$100.1 17.42,67.07 15.82,68.67 8.81,68.67 J5.P$20
EW105
  Top 0.152: U$105.1 34.52,56.97 34.52,69.27 39.92,74.67 42.89,74.67 42.9,74.68 J6.P$1
EW106
  Top 0.152: U$107.1 36.92,60.57 36.92,68.97 40.12,72.17 42.87,72.17 42.9,72.14 J6.P$3
EW107
  Top 0.152: U$109.1 37.52,56.97 37.52,67.07 40.02,69.57 42.88,69.57 42.9,69.6 J6.P$5
EW108
  Top 0.152: U$111.1 39.92,60.57 39.92,66.77 40.21,67.06 J6.P$7
EW109
  Top 0.152: U$113.1 31.52,46.17 39.62,46.17 40.12,45.67 49.92,45.67 50.12,45.87 50.12,62.77 49.62,63.27 44.15,63.27 42.9,64.52 J6.P$9
EW110  (via drill 0.38)
  Top 0.152: v42.92,60.77 42.94,60.79 J6.P$11
  Bottom 0.152: U$115.1 43.12,44.07 44.92,45.87 44.92,58.77 v42.92,60.77
EW111
  Top 0.152: U$117.1 31.52,55.17 38.92,55.17 39.32,55.57 39.32,58.37 40.37,59.42 42.88,59.42 42.9,59.44 J6.P$13
EW112  (via drill 0.38)
  Top 0.152: v42.92,55.67 42.92,56.88 42.9,56.9 J6.P$15
  Bottom 0.152: U$119.1 40.42,53.07 42.92,55.57 v42.92,55.67
EW113
  Top 0.152: U$121.1 31.52,52.17 38.62,52.17 40.82,54.37 42.89,54.37 42.9,54.36 J6.P$17
EW114
  Top 0.152: U$123.1 40.42,50.07 42.12,51.77 42.85,51.77 42.9,51.82 J6.P$19
EW115
  Top 0.152: U$125.1 31.52,49.17 42.79,49.17 42.9,49.28 J6.P$21
EW116
  Top 0.152: U$127.1 42.57,47.07 42.9,46.74 J6.P$23
EW117
  Top 0.152: U$106.1 35.42,69.27 39.82,73.67 46.95,73.67 47.95,74.68 J6.P$2
EW118
  Top 0.152: U$108.1 36.32,62.97 36.32,69.27 40.12,73.07 47.02,73.07 47.95,72.14 J6.P$4
EW119
  Top 0.152: U$110.1 38.42,67.07 40.02,68.67 47.02,68.67 47.95,69.6 J6.P$6
EW120
  Top 0.152: U$112.1 39.32,62.97 39.32,67.07 40.32,68.07 46.94,68.07 47.95,67.06 J6.P$8
EW121
  Top 0.152: U$114.1 33.92,45.57 39.32,45.57 39.82,45.07 50.22,45.07 50.72,45.57 50.72,63.47 49.72,64.47 48.04,64.47 | 48.04,64.47 48,64.47 47.95,64.52 | J6.P$10 48.04,64.47
EW122  (via drill 0.38)
  Top 0.152: U$116.1 36.32,44.97 38.92,44.97 39.72,44.17 v44.62,44.17 | v48.02,60.77 47.99,60.8 J6.P$12
  Bottom 0.152: v48.02,60.77 v48.02,60.76 45.97,58.71 45.97,45.47 44.68,44.17 v44.62,44.17
EW123
  Top 0.152: U$118.1 33.92,54.57 39.12,54.57 39.92,55.37 39.92,57.97 40.42,58.47 46.98,58.47 47.95,59.44 J6.P$14
EW124
  Top 0.152: U$120.1 36.32,53.97 39.32,53.97 40.52,55.17 40.52,57.57 40.82,57.87 46.98,57.87 47.95,56.9 J6.P$16
EW125
  Top 0.152: U$122.1 33.92,51.57 38.82,51.57 40.62,53.37 46.96,53.37 47.95,54.36 J6.P$18
EW126
  Top 0.152: U$124.1 36.32,50.97 39.02,50.97 40.82,52.77 47,52.77 47.95,51.82 J6.P$20
EW127
  Top 0.152: U$126.1 33.92,48.57 40.42,48.57 40.72,48.27 46.95,48.27 47.95,49.28 J6.P$22
EW128
  Top 0.152: U$128.1 36.32,47.97 40.42,47.97 40.72,47.67 47.02,47.67 47.95,46.74 J6.P$24
EW137
  Top 0.152: 12.9,35.86 12.94,35.86 J3.P$21 13.09,35.97 24.32,35.97 U$53.1
EW166
  Top 0.152: U$98.1 16.52,62.97 16.52,67.07 15.52,68.07 8.9,68.07 J5.P$18
EW236
  Top 0.152: U$97.1 15.92,60.57 15.92,66.77 15.63,67.06 J5.P$17
EW261
  Top 0.152: U$33.1 21.32,28.17 21.32,15.87 15.92,10.47 13.02,10.47 | 13.02,10.47 12.95,10.47 12.94,10.46 12.9,10.46 | J3.P$1 12.96,10.41 13.02,10.47
EW287
  Top 0.152: U$102.1 19.52,62.97 19.52,69.27 15.72,73.07 8.82,73.07 J5.P$22
EW289
  Top 0.152: U$104.1 20.42,69.27 16.02,73.67 8.89,73.67 J5.P$24

### Text on the board
tPlace: 89 | 105 | 81 | 113 | 77 | 117 | 65 | 1 | 53 | 13 | 49 | 17 | 41 | 25 | EW-1 (3 mm)